# Altium schematic sheet current limiter.SchDoc
size A4
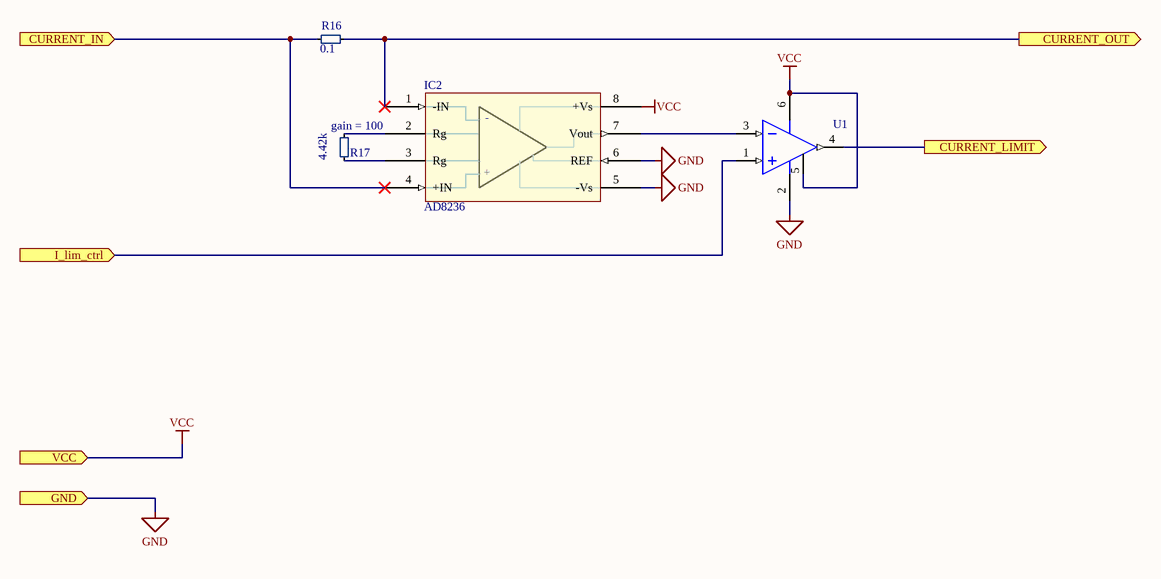
[diagram p0: current limiter.SchDoc]

## Parts
IC2  AD8236  [8-MSOP]
R16  Resistance: 0.1  [Chip2PinSM127P600-8N]  (hidden comment: ERJ-8BSFR10V)
R17  Resistance: 4.42k  [SMD_0402(1005)_M]  (hidden comment: RC0402FR-074K42L)
U1  LMV341IDBVR  [SOT95P280X145-6N]  (value not drawn)

## Ports
CURRENT_IN (in), CURRENT_LIMIT (out), CURRENT_OUT (out), GND (in), I_lim_ctrl (in), VCC (in)

## Nets
GND: IC2.5(-Vs) IC2.6(REF) U1.2(VEE/GND) ; port GND
VCC: IC2.8(+Vs) U1.5(!SHDN) U1.6(VCC) ; port VCC
CURRENT_IN: IC2.4(+IN) R16.1 ; port CURRENT_IN
CURRENT_LIMIT: U1.4(OUT1) ; port CURRENT_LIMIT
CURRENT_OUT: IC2.1(-IN) R16.2 ; port CURRENT_OUT
I_lim_ctrl: U1.1(IN1+) ; port I_lim_ctrl
NetIC2_2: IC2.2(Rg) R17.2
NetIC2_3: IC2.3(Rg) R17.1
NetIC2_7: IC2.7(Vout) U1.3(IN1-)

## Notes on the sheet
- (near R17) gain = 100
- (in symbol CMP-006-0000-5) -; +

## Library data of the parts
IC2 = CMP-006-0000-5: IC OPAMP INSTR 23KHZ RRO 8MSOP; Number of Channels: 1; Slew Rate: 0.011V/µs; Input Offset Voltage (Vos): 3.5mV; Common Mode Rejection Ratio: 110dB; Input Resistance: 440GR; Voltage Gain: 46.02dB; Min Supply Voltage: 1.8V; Input Bias Current: 10pA; Power Supply Rejection Ratio (PSRR): 130dB; Operating Supply Current: 40uA; Max Supply Voltage: 5.5V; Output Current per Channel: 6mA; Pin Count: 8; Design Item ID: AD8236; Source: opamp.SchLib; Package Quantity: 1; Packaging: Tape and Reel; Contact Plating: Gold; Radiation Hardening: No; Number of Elements: 1; Min Operating Temperature: -40°C; Max Operating Temperature: 125°C; Case/Package: MSOP; Lead Free: Contains Lead; Number of Circuits: 1; -3db Bandwidth: 23kHz; Mount: Surface Mount; Number of Pins: 8
R16 = CMP-0001-00003-2: Precision resistor, SMD 0.1 Ohm 0.33 W  ±  1 % 1206, ERJ8BSFR10V, Panasonic Automotive & Industrial Systems; Temperature Coefficient: 250ppm/°C; Value: 0.1; Tolerance: 1%; Power Rating: 330mW; Max Power Dissipation: 500mW; Case Code (Imperial): 1206; Min Operating Temperature: -55°C; Max Operating Temperature: 125°C; Case Code (Metric): 3216; Termination: SMD/SMT; Military Standard: Not; REACH SVHC: No SVHC; Features: Automotive AEC-Q200; Package Quantity: 5000; Length: 3.2mm; Depth: 1.6mm; Mount: Surface Mount; Case/Package: 1206; Contact Plating: Tin; Number of Terminations: 2; Radiation Hardening: No; Packaging: Tape and Reel; Composition: Thick Film,Low-Ohm-Resistor; RoHS: Yes; Width: 0.063inch; Height: 0.6mm; Number of Pins: 2
R17 = CMP-0001-00002-5: RES SMD 4.42K OHM 1% 1/16W 0402; Power Rating: 62.5mW; Max Power Dissipation: 63mW; Temperature Coefficient: 100ppm/°C; Voltage Rating: 50V; Case Code (Imperial): 0402; Length: 1mm; Min Operating Temperature: -55°C; Tolerance: 1%; Number of Terminations: 2; RoHS: Yes; Features: Moisture Resistant; Height: 0.016inch; Mount: SMD; Composition: Thick Film; Lead Free: Lead Free; Max Operating Temperature: 155°C; Termination: SMD/SMT; Military Standard: Not; Case Code (Metric): 1005; Case/Package: 0402; Contact Plating: Tin,Matte; Depth: 0.5mm; Width: 0.02inch; Packaging: Tape and Reel; Value: 4.42k
U1 = CMP-ROOT-00000-1: Single Rail-To-Rail Output CMOS Operational Amplifier with Shutdown 6-SOT-23 -40 to 125; Voltage Gain: 116dB; Output Current: 32mA; Number of Channels: 1; Common Mode Rejection Ratio: 56dB; Input Offset Voltage (Vos): 250uV; Bandwidth: 1MHz; Max Supply Voltage: 5.5V; Max Frequency: 1kHz; Output Current per Channel: 113mA; Operating Supply Current: 107uA; Slew Rate: 1V/µs; Input Bias Current: 200pA; Nominal Supply Current: 170uA; Min Supply Voltage: 2.5V; Radiation Hardening: No; Number of Amplifiers: 1; Height: 1.3mm; Number of Circuits: 1; Gain Bandwidth Product: 1MHz; Unity Gain Bandwidth Product: 1MHz; Package Quantity: 1; RoHS: Yes; Width: 1.75mm; Length: 3.05mm; Mount: Surface Mount; REACH SVHC: No SVHC; Contact Plating: Gold; Packaging: Tape and Reel; Number of Pins: 6; Lead Free: Lead Free; Case/Package: SOT-23; Number of Elements: 1; Max Operating Temperature: 125°C; Min Operating Temperature: -40°C